# EasyEDA Pro project P1.epro

# Schematic Schematic4
Board Name: Light source; Create Date: 2026-08-11; Page Name: P1; Project Name: Banc d'essai; Schematic Name: Schematic4; Update Date: 2026-09-05; Company: EasyEDA.com; Page Size: A3; Version: V1.0
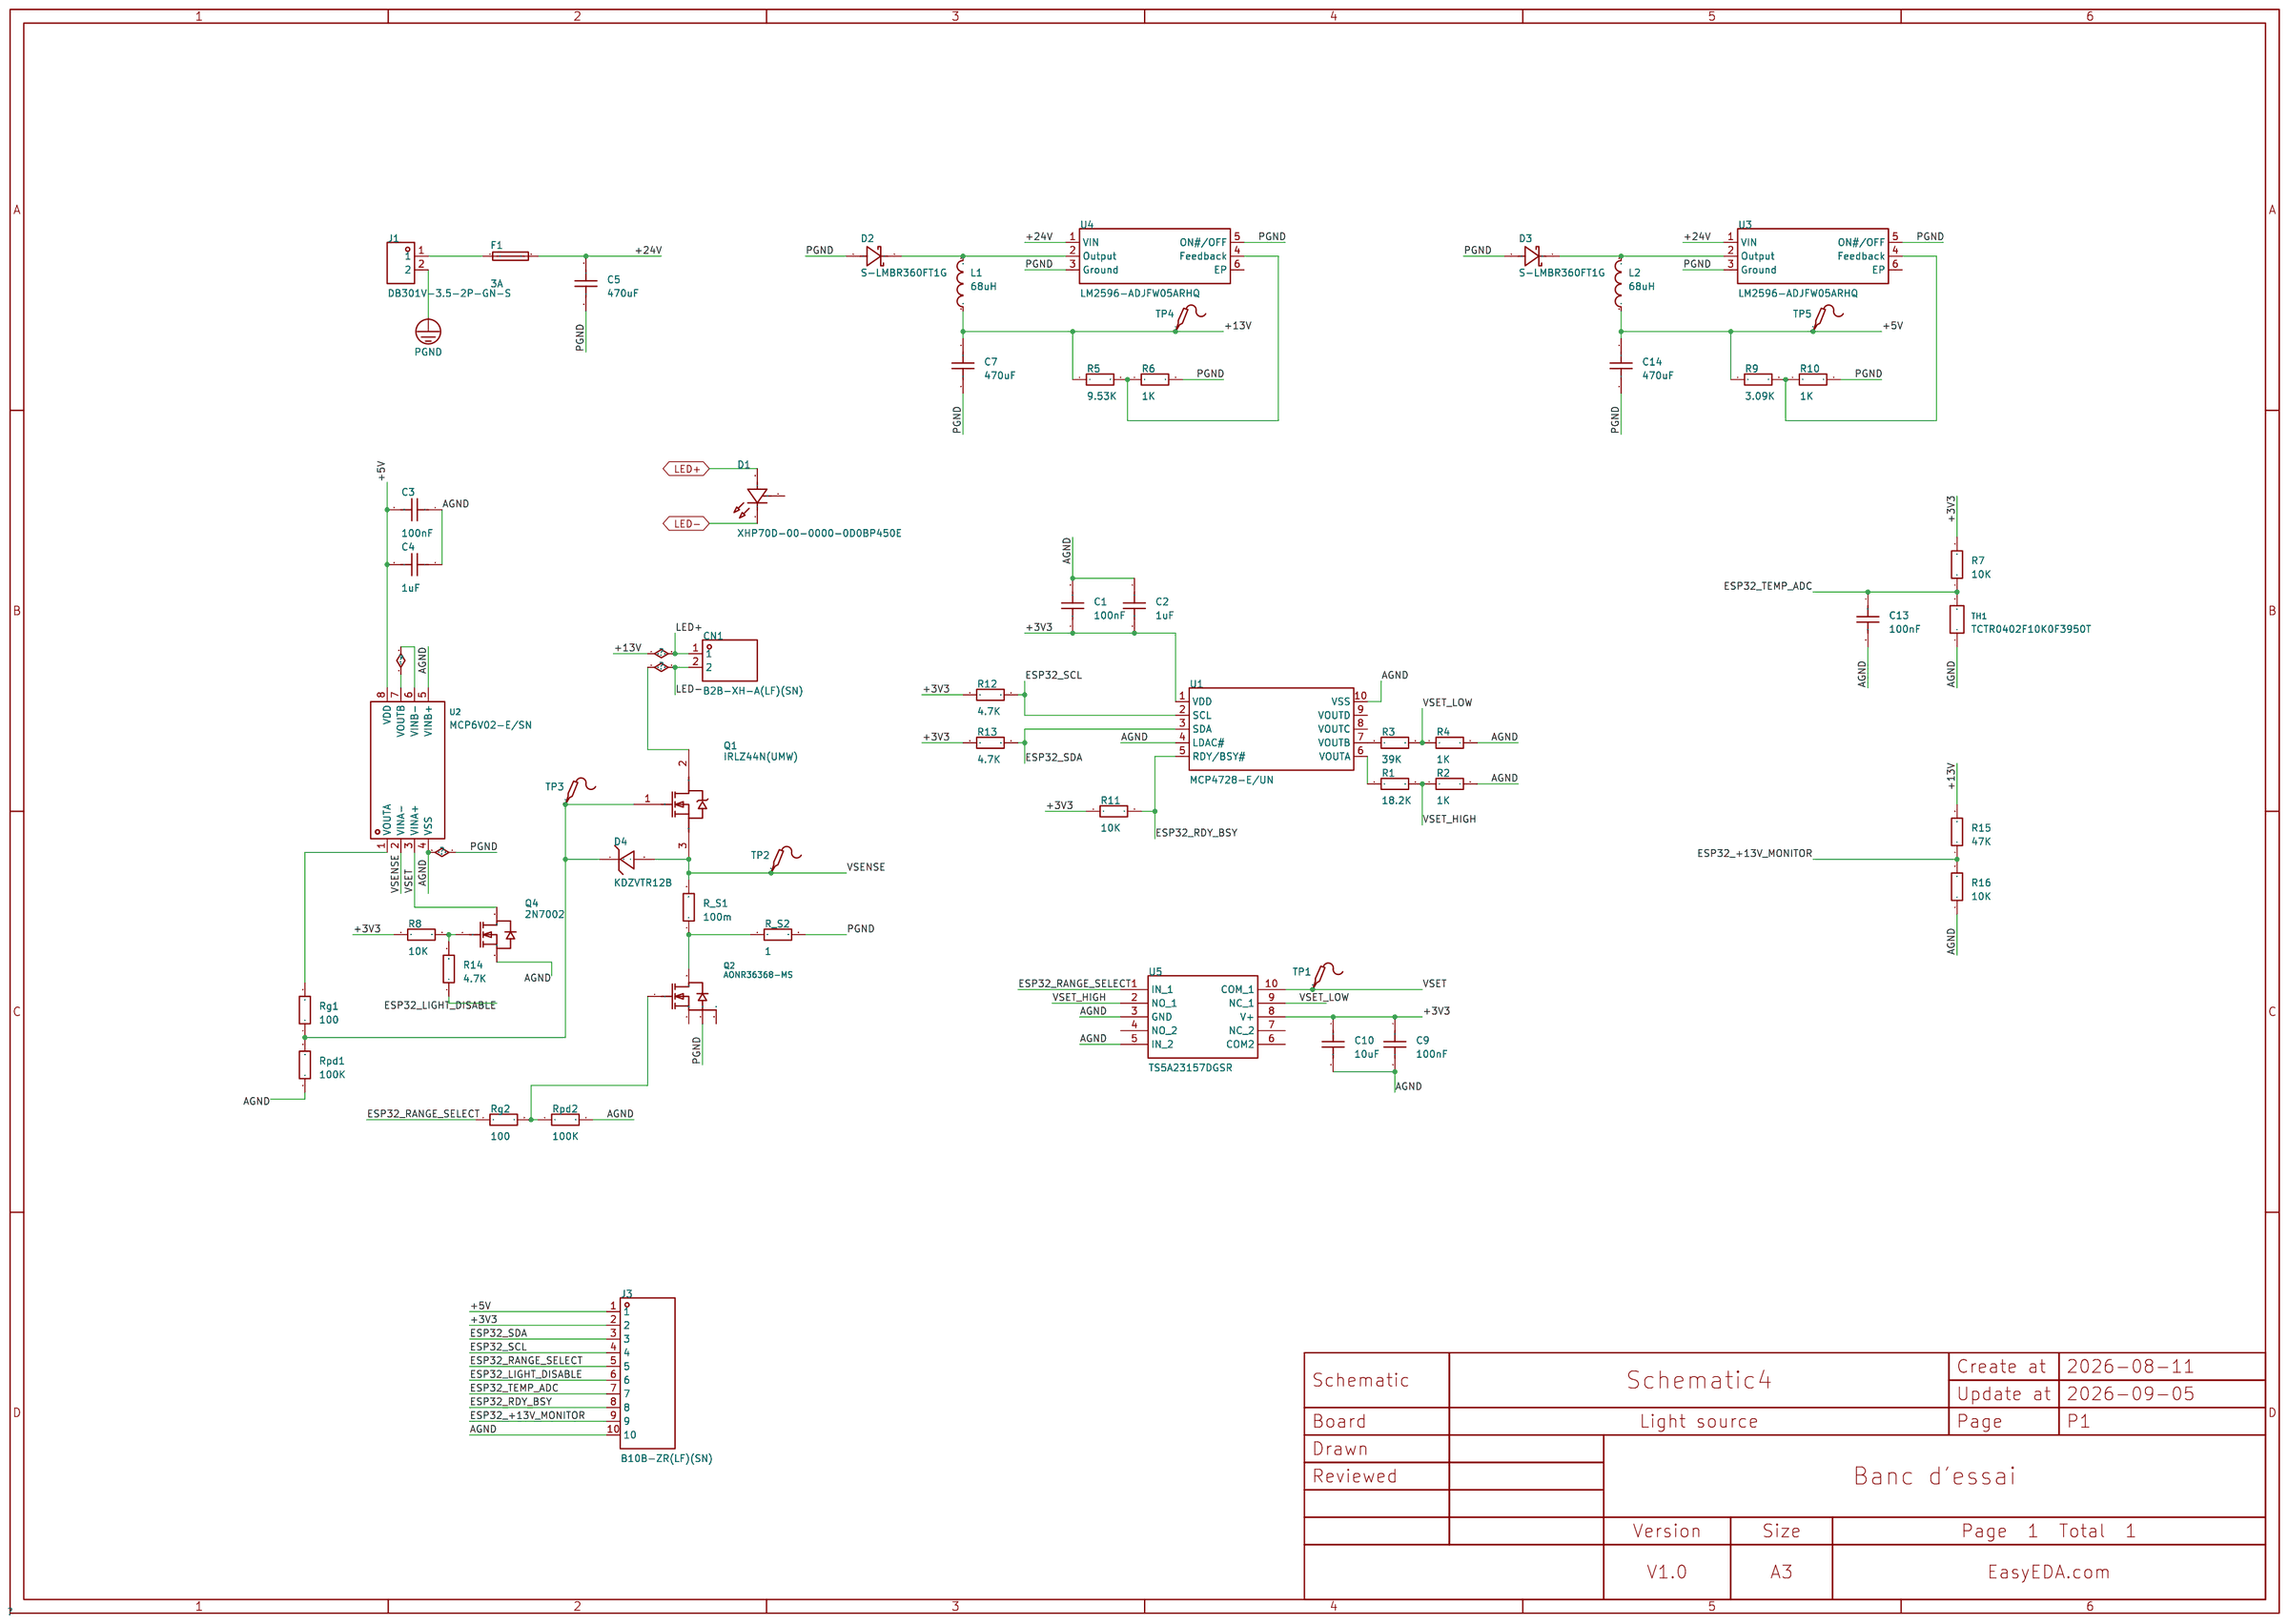
[diagram p0: schematic sheet]

## Parts
C1  100nF  [C0603]
C2  1uF  [C0603]
C3  100nF  [C0603]
C4  1uF  [C0603]
C5  470uF  [C0603]
C7  470uF  [C0603]
C9  100nF  [C0603]
C10  10uF  [C0603]
C13  100nF  [C0603]
C14  470uF  [C0603]
CN1  B2B-XH-A(LF)(SN)  [CONN-TH_B2B-XH-A-LF-SN]
D1  XHP70D-00-0000-0D0BP450E  [LED-SMD_3P-L7.0-W7.0_XHP70B-00-0000-0D0BP20E2]
D2  S-LMBR360FT1G  [SOD-123FL_L2.8-W1.9-LS3.7-RD]
D3  S-LMBR360FT1G  [SOD-123FL_L2.8-W1.9-LS3.7-RD]
D4  KDZVTR12B  [SOD-123FL_L2.7-W1.8-LS3.8-RD]
F1  3A  [FUSE-TH_L24.4-W9.4-P22.60]
J1  DB301V-3.5-2P-GN-S  [CONN-TH_DB301V-3.5-2P-GN]
J3  B10B-ZR(LF)(SN)  [CONN-TH_B10B-ZR-LF-SN]
L1  68uH  [L0603]
L2  68uH  [L0603]
Q1  IRLZ44N(UMW)  [TO-220-3_L10.2-W4.5-P2.54-L]
Q2  AONR36368-MS  [DFN-8_L3.1-W3.1-P0.65-BL-EP_AONR36368-MS]
Q4  2N7002  [SOT-23-3_L2.9-W1.3-P1.90-LS2.4-BR]
R1  18.2K  [R0603]
R2  1K  [R0603]
R3  39K  [R0603]
R4  1K  [R0603]
R5  9.53K  [R0603]
R6  1K  [R0603]
R7  10K  [R0603]
R8  10K  [R0603]
R9  3.09K  [R0603]
R10  1K  [R0603]
R11  10K  [R0603]
R12  4.7K  [R0603]
R13  4.7K  [R0603]
R14  4.7K  [R0603]
R15  47K  [R0603]
R16  10K  [R0603]
R_S1  100m  [R0603]
R_S2  1  [R0603]
Rg1  100  [R0603]
Rg2  100  [R0603]
Rpd1  100K  [R0603]
Rpd2  100K  [R0603]
TH1  TCTR0402F10K0F3950T  [R0402]
TP1  -  [Test-Point-0.5mm]
TP2  -  [Test-Point-0.5mm]
TP3  -  [Test-Point-0.5mm]
TP4  -  [Test-Point-0.5mm]
TP5  -  [Test-Point-0.5mm]
U1  MCP4728-E/UN  [MSOP-10_L3.0-W3.0-P0.50-LS5.0-TL]
U2  MCP6V02-E/SN  [SOIC-8_L4.9-W3.9-P1.27-LS6.0-BL]
U3  LM2596-ADJFW05ARHQ  [TO-263-5_L10.1-W8.7-P1.70-LS14.4-BR]
U4  LM2596-ADJFW05ARHQ  [TO-263-5_L10.1-W8.7-P1.70-LS14.4-BR]
U5  TS5A23157DGSR  [MSOP-10_L3.0-W3.0-P0.50-LS5.0-BL]

## Library data of the parts
C1-C5 C7 C9 C10 C13 C14 = CAP_0603: Supplier Footprint: 0603
CN1 = B2B-XH-A(LF)(SN): Pins Structure:1x2P Pitch:2.5mm Mounting Type:Through Hole Reference Series:XH Number of Pins:2P Number of Rows:1 Number of PINs Per Row:2 Row Spacing:- Current Rating:3A Contact Material:Brass Contact Plating:Tin Operating Temperature:-25℃~+85℃ Operating; LCSC Part Name: 1x2P 间距:2.5mm 直插 系列:XH; Supplier Part: C158012; Manufacturer: JST; Supplier Footprint: 插件,P=2.5mm; JLCPCB Part Class: Extended Part; Datasheet: https://item.szlcsc.com/datasheet/B2B-XH-A(LF)(SN)/169360.html; Supplier: LCSC; Pins Structure: 1x2P; Pitch: 2.5mm; Mounting Type: Through Hole; Reference Series: XH; Number of Pins: 2P; Number of Rows: 1; Number of PINs Per Row: 2; Current Rating: 3A; Contact Material: Brass; Contact Plating: Tin; Operating Temperature: -25℃~+85℃; Voltage Rating: 250V; Plastic Material: PA66; Flame Retardant Rating: UL94V-0; Supplementary Features: K Pin; Color: White; Z-Height of the Board: 7mm; X-Length of Bottom Edge on Board (Spacing Line): 7.4mm; Y-Width of Bottom Edge on Board: 5.75mm
D1 = XHP70D-00-0000-0D0BP450E: Illumination Color:White Voltage - Forward(Vf):11.2V Voltage - Forward(Vf):11.2V Forward Current:1.05A Color Temperature:5000K Color Temperature:5000K Viewing Angle:120°; Supplier Part: C17579168; Manufacturer: CREE LED; Supplier Footprint: 2828; JLCPCB Part Class: Extended Part; Datasheet: https://item.szlcsc.com/datasheet/XHP70D-00-0000-0D0BP450E/18708400.html; Supplier: LCSC; Illumination Color: White; Voltage - Forward(Vf): 11.2V; Forward Current: 1.05A; Color Temperature: 5000K; Viewing Angle: 120°
D2 D3 = S-LMBR360FT1G: Voltage - Forward(Vf@If):700mV@3A Voltage - DC Reverse(Vr):60V Current - Rectified:3A Operating Junction Temperature Range:-55℃~+150℃ Operating Junction Temperature Range:-55℃~+150℃ Non-Repetitive Peak Forward Surge Current:80A; LCSC Part Name: 电压:60V 电流:3A; Supplier Part: C5383051; Manufacturer: LRC(乐山无线电); Supplier Footprint: SOD-123FL; JLCPCB Part Class: Extended Part; Datasheet: https://item.szlcsc.com/datasheet/S-LMBR360FT1G/6258190.html; Supplier: LCSC; Voltage - Forward(Vf@If): 700mV@3A; Voltage - DC Reverse(Vr): 60V; Current - Rectified: 3A; Operating Junction Temperature Range: -55℃~+150℃; Non-Repetitive Peak Forward Surge Current: 80A
D4 = KDZVTR12B: Diode Configuration:1 Independent Zener Voltage(Nom):12V Reverse Leakage Current (Ir):10uA@9V Zener Voltage(Range):12V~13.5V Zener Voltage(Range):12V~13.5V Pd - Power Dissipation:1W Impedance(Zzt):- Impedance(Zzk):- Operating Junction Temperature Range:-; LCSC Part Name: 独立式 耐压:12V 电流:10uA@9V; Supplier Part: C209599; Manufacturer: ROHM(罗姆); Supplier Footprint: SOD-123FL; JLCPCB Part Class: Extended Part; Datasheet: https://item.szlcsc.com/datasheet/KDZVTR12B/210588.html; Supplier: LCSC; Diode Configuration: 1 Independent; Zener Voltage(Nom): 12V; Reverse Leakage Current (Ir): 10uA@9V; Zener Voltage(Range): 12V~13.5V; Pd - Power Dissipation: 1W
F1 = PTF-77: Fuseholder Type:Bracket type Number of Circuits:1 Voltage Rating:250V Current Rating:20A Fuse Type:Cylindrical Fuse Diameter (φD):5mm Fuse Length:20mm; LCSC Part Name: 2件套 保险丝座 5x20mm 绿色; Supplier Part: C717030; Manufacturer: XFCN(兴飞); Supplier Footprint: 插件,P=22.5mm; JLCPCB Part Class: Extended Part; Datasheet: https://item.szlcsc.com/datasheet/PTF-77/757629.html; Supplier: LCSC; Fuseholder Type: Bracket type; Number of Circuits: 1; Voltage Rating: 250V; Current Rating: 20A; Fuse Type: Cylindrical; Fuse Diameter (φD): 5mm; Fuse Length: 20mm
J1 = DB301V-3.5-2P-GN-S: Number of Positions or Pins:1x2P Pitch:3.5mm Color:Green Mounting Type:Through Hole Number of Pins:2P Number of Rows:1 Number of PINs Per Row:2 Screw Specification:M2 Current Rating:7A Voltage Rating (Max):300V Wire Gauge - AWG:18~24 Wire Gauge - mm2:0.5~; LCSC Part Name: 1x2P 3.5mm 直插 排数:1 每排P数:2; Supplier Part: C695629; Manufacturer: DORABO(地博电气); Supplier Footprint: 插件,P=3.5mm; JLCPCB Part Class: Extended Part; Datasheet: https://item.szlcsc.com/datasheet/DB301V-3.5-2P-GN-S/728965.html; Supplier: LCSC; Number of Positions or Pins: 1x2P; Pitch: 3.5mm; Color: Green; Mounting Type: Through Hole; Number of Pins: 2P; Number of Rows: 1; Number of PINs Per Row: 2; Screw Specification: M2; Current Rating: 7A; Voltage Rating (Max): 300V; Wire Gauge - AWG: 18~24; Wire Gauge - mm2: 0.5~1; Operating Temperature: -40℃~+105℃; Height Above Board: 8.5mm
J3 = B10B-ZR(LF)(SN): Pins Structure:1x10P Pitch:1.5mm Mounting Type:Through Hole Reference Series:ZH Number of Pins:10P Number of Rows:1 Number of PINs Per Row:10 Row Spacing:- Current Rating:1A Contact Material:Brass Contact Plating:Tin Operating Temperature:-25℃~+85℃ Operat; LCSC Part Name: 1x10P 间距:1.5mm 直插 系列:ZH; Supplier Part: C158036; Manufacturer: JST; Supplier Footprint: 插件,P=1.5mm; JLCPCB Part Class: Extended Part; Datasheet: https://item.szlcsc.com/datasheet/B10B-ZR(LF)(SN)/169384.html; Supplier: LCSC; Pins Structure: 1x10P; Pitch: 1.5mm; Mounting Type: Through Hole; Reference Series: ZH; Number of Pins: 10P; Number of Rows: 1; Number of PINs Per Row: 10; Current Rating: 1A; Contact Material: Brass; Contact Plating: Tin; Operating Temperature: -25℃~+85℃; Voltage Rating: 50V; Plastic Material: Glass fiber reinforced PA66; Flame Retardant Rating: UL94V-0; Color: White; Z-Height of the Board: 4.5mm; X-Length of Bottom Edge on Board (Spacing Line): 16.5mm; Y-Width of Bottom Edge on Board: 3.5mm
L1 L2 = L_0603
Q1 = IRLZ44N(UMW): Number:1 N-Channel Drain to Source Voltage:55V Current - Continuous Drain(Id):47A RDS(on):22mΩ@10V Pd - Power Dissipation:110W Gate Threshold Voltage (Vgs(th)):2V@250uA Gate Charge(Qg):48nC Input Capacitance(Ciss):1.7nF Reverse Transfer Capacitance (Crss@; LCSC Part Name: 55V N沟道MOSFET; Supplier Part: C42370423; Manufacturer: UMW(友台半导体); Supplier Footprint: TO-220; JLCPCB Part Class: Extended Part; Datasheet: https://item.szlcsc.com/datasheet/IRLZ44N(UMW)/44244386.html; Supplier: LCSC; Number: 1 N-Channel; Drain to Source Voltage: 55V; Current - Continuous Drain(Id): 47A; RDS(on): 22mΩ@10V; Pd - Power Dissipation: 110W; Gate Threshold Voltage (Vgs(th)): 2V@250uA; Gate Charge(Qg): 48nC; Input Capacitance(Ciss): 1.7nF; Reverse Transfer Capacitance (Crss@Vds): 150pF; Operating Temperature: -55℃~+175℃; Type: N-Channel; Output Capacitance(Coss): 400pF
Q2 = AONR36368-MS: Type:1 N-Channel Drain Source Voltage (Vdss): Continuous Drain Current (Id): Drain Source On Resistance (RDS(on)@Vgs,Id):6mΩ@10V Gate Threshold Voltage (Vgs(th)@Id):2.5V; LCSC Part Name: 1个N沟道 耐压:30V 电流:60A; Supplier Part: C17702943; Manufacturer: MSKSEMI(美森科); Supplier Footprint: DFN3x3-8L; JLCPCB Part Class: Extended Part; Datasheet: https://atta.szlcsc.com/upload/public/pdf/source/20230927/CF83EEA58387C726CE4325E11C2D3B0B.pdf; Supplier: LCSC; Type: 1 N-Channel; Drain Source On Resistance (RDS(on)@Vgs,Id): 6mΩ@10V; Gate Threshold Voltage (Vgs(th)@Id): 2.5V
Q4 = 2N7002_C8545: Number:1 N-channel Drain to Source Voltage:60V Current - Continuous Drain(Id):115mA RDS(on):5Ω@10V Pd - Power Dissipation:225mW Gate Threshold Voltage (Vgs(th)):2.5V Gate Charge(Qg):- Input Capacitance(Ciss):50pF Reverse Transfer Capacitance (Crss@Vds):5p; LCSC Part Name: 1个N沟道 耐压:60V 电流:115mA; Supplier Part: C8545; Manufacturer: CJ(江苏长电/长晶); Supplier Footprint: SOT-23; JLCPCB Part Class: Basic Part; Datasheet: https://item.szlcsc.com/datasheet/2N7002/9040.html; Supplier: LCSC; Number: 1 N-channel; Drain to Source Voltage: 60V; Current - Continuous Drain(Id): 115mA; RDS(on): 5Ω@10V; Pd - Power Dissipation: 225mW; Gate Threshold Voltage (Vgs(th)): 2.5V; Input Capacitance(Ciss): 50pF; Reverse Transfer Capacitance (Crss@Vds): 5pF; Type: N-Channel; Output Capacitance(Coss): 25pF; Vgs: ±20V
R1-R16 R_S1 R_S2 Rg1 Rg2 Rpd1 Rpd2 = Res_0603: Supplier Footprint: 0603
TH1 = TCTR0402F10K0F3950T: Resistance @ 25℃: B Constant (25℃/50℃): Resistance Tolerance: B Constant (25℃/75℃):- B Constant (25℃/85℃):- B Constant (25℃/100℃):- Power: B Constant Tolerance: Steady State Current (Max):- Operating Temperature:-40℃~+125℃ Operating Temperature:-40℃~+125℃; LCSC Part Name: 10kΩ 电阻精度:±1% 3950K; Supplier Part: C525371; Manufacturer: RESI(开步睿思）; Supplier Footprint: 0402; JLCPCB Part Class: Extended Part; Datasheet: https://atta.szlcsc.com/upload/public/pdf/source/20200506/C525364_82DA399420FD8342B6C8F2E2EC87328D.pdf; Supplier: LCSC; Operating Temperature: -40℃~+125℃
TP1-TP5 = Test-Point: Test Point 测试点
U1 = MCP4728-E/UN: Resolution (Bits):12 Number of Channels:4 Interface:I2C Voltage - Supply:2.7V~5.5V Voltage - Supply:2.7V~5.5V Settling Time:6us Output Type:Voltage Buffer Integral non - linearity:2LSB Integral non - linearity:2LSB Operating Temperature:-40℃~+125℃ Operati; LCSC Part Name: 12位四通道带EEPROM存储器的数模转换器; Supplier Part: C108207; Manufacturer: MICROCHIP(美国微芯); Supplier Footprint: MSOP-10; JLCPCB Part Class: Extended Part; Datasheet: https://item.szlcsc.com/datasheet/MCP4728-E%252FUN/109426.html; Supplier: LCSC; Resolution (Bits): 12; Number of Channels: 4; Interface: I2C; Voltage - Supply: 2.7V~5.5V; Settling Time: 6us; Output Type: Voltage Buffer; Integral non - linearity: 2LSB; Operating Temperature: -40℃~+125℃; Function: Programmable gain；Integrated buffer；Power-down mode；Power-on reset; Quiescent Current (Iq): 40nA
U2 = MCP6V02-E/SN: Number of Circuits:双路 Gain Bandwidth Product(GBP):1.3MHz Current - Input Bias(Ib):1pA Voltage - Input Offset(Vos):2uV Slew Rate(SR):0.5V/us Supply Voltage:1.8V~5.5V Supply Voltage:1.8V~5.5V -3db Bandwidth(G=1):- Output Type:- Rail to Rail:- Supply Current; Supplier Part: C47081; Manufacturer: MICROCHIP(美国微芯); Supplier Footprint: SOIC-8; JLCPCB Part Class: Extended Part; Datasheet: https://atta.szlcsc.com/upload/public/pdf/source/20220119/C1348516_7056A8E4D422962B4648026286D6E4C0.pdf; Supplier: LCSC; Number of Circuits: 双路; Gain Bandwidth Product(GBP): 1.3MHz; Current - Input Bias(Ib): 1pA; Voltage - Input Offset(Vos): 2uV; Slew Rate(SR): 0.5V/us; Supply Voltage: 1.8V~5.5V; Supply Current: 300uA; Operating Temperature: -40℃~+125℃
U3 U4 = LM2596-ADJFW05ARHQ: Function:Step-down type Voltage - Supply:4.5V~40V Voltage - Supply:4.5V~40V Output Voltage:1.2V~37V Output Voltage:1.2V~37V Output Current:3A Frequency - Switching:150kHz Frequency - Switching:150kHz Operating Temperature:-40℃~+125℃ Operating Temperature:; LCSC Part Name: 降压型 3A 4.5V~40V; Supplier Part: C49443605; Manufacturer: GR(国睿); Supplier Footprint: TO-263-5; JLCPCB Part Class: Extended Part; Datasheet: https://item.szlcsc.com/datasheet/LM2596-ADJFW05ARHQ/51983582.html; Supplier: LCSC; Function: Step-down type; Voltage - Supply: 4.5V~40V; Output Voltage: 1.2V~37V; Output Current: 3A; Frequency - Switching: 150kHz; Operating Temperature: -40℃~+125℃; Number of Outputs: 1; Topology: Buck; Quiescent Current: 5mA; Switch tube (built-in/external): Built-in; Output Type: Adjustable; Features: Overcurrent Protection
U5 = TS5A23157DGSR: Switch Circuit:2:1 Number of Channels:2 Ron:10Ω Voltage - Supply:1.65V~5.5V Voltage - Supply:1.65V~5.5V Con:17.5pF Turn-on time:1.7ns Turn-off time:800ps Bandwidth:220MHz Operating Temperature:-40℃~+85℃ Operating Temperature:-40℃~+85℃ Propagation Delay (t; LCSC Part Name: TS5A23157 双 10Ω SPDT 模拟开关; Supplier Part: C11133; Manufacturer: TI(德州仪器); Supplier Footprint: MSOP-10; JLCPCB Part Class: Extended Part; Datasheet: https://www.ti.com/cn/lit/gpn/ts5a23157; Supplier: LCSC; Switch Circuit: 2:1; Number of Channels: 2; Ron: 10Ω; Voltage - Supply: 1.65V~5.5V; Con: 17.5pF; Turn-on time: 1.7ns; Turn-off time: 800ps; Bandwidth: 220MHz; Operating Temperature: -40℃~+85℃; Features: Bidirectional analog channel；Glitch-free switching

## Nets
+3V3: C1.1 C2.2 C9.1 C10.1 J3.2 R7.2 R8.1 R11.1 R12.1 R13.1 U1.1(VDD) U5.8(V+)
+5V: C3.2 C4.2 C14.1 J3.1 L2.1 R9.1 TP5.1 U2.8(VDD)
+13V: C7.1 CN1.1 D1.3(A) L1.1 R5.1 R15.2 TP4.1
+24V: C5.1 F1.2 U3.1(VIN) U4.1(VIN)
PGND: C1.2 C2.1 C3.1 C4.1 C5.2 C7.2 C9.2 C10.2 C13.2 C14.2 D2.2(A) D3.2(A) J1.2 J3.10 Q2.2(S) Q4.2(S) R2.2 R4.2 R6.2 R10.2 R16.1 R_S2.2 Rpd1.1 Rpd2.2 TH1.1 U1.4(LDAC#) U1.10(VSS) U2.4(VSS) U2.5(VINB+) U3.3(Ground) U3.5(ON#/OFF) U4.3(Ground) U4.5(ON#/OFF) U5.3(GND) U5.5(IN 2)
ESP32_+13V_MONITOR: J3.9 R15.1 R16.2
ESP32_LIGHT_DISABLE: J3.6 R14.1
ESP32_RANGE_SELECT: J3.5 Rg2.1 U5.1(IN 1)
ESP32_RDY_BSY: J3.8 R11.2 U1.5(RDY/BSY#)
ESP32_SCL: J3.4 R12.2 U1.2(SCL)
ESP32_SDA: J3.3 R13.2 U1.3(SDA)
ESP32_TEMP_ADC: C13.1 J3.7 R7.1 TH1.2
LED-: CN1.2 D1.1(K) Q1.2(D)
VSENSE: D4.2(A) Q1.3(S) R_S1.2 TP2.1 U2.2(VINA-)
VSET: Q4.3(D) TP1.1 U2.3(VINA+) U5.10(COM 1)
VSET_HIGH: R1.2 R2.1 U5.2(NO 1)
VSET_LOW: R3.2 R4.1 U5.9(NC 1)
Net-(D2-1): D2.1(K) L1.2 U4.2(Output)
Net-(D3-1): D3.1(K) L2.2 U3.2(Output)
Net-(D4-1): D4.1(K) Q1.1(G) Rg1.1 Rpd1.2 TP3.1
Net-(F1-1): F1.1 J1.1
Net-(Q2-4): Q2.4(G) Rg2.2 Rpd2.1
Net-(Q2-5): Q2.5(D) R_S1.1 R_S2.1
Net-(Q4-1): Q4.1(G) R8.2 R14.2
Net-(R1-1): R1.1 U1.6(VOUTA)
Net-(R3-1): R3.1 U1.7(VOUTB)
Net-(R5-2): R5.2 R6.1 U4.4(Feedback)
Net-(R9-2): R9.2 R10.1 U3.4(Feedback)
Net-(Rg1-2): Rg1.2 U2.1(VOUTA)
Net-(U2-6): U2.6(VINB-) U2.7(VOUTB)

Not connected (* = marked no-connect by the designer): D1 2(NC); Q2 1(S) 3(S); U1 8(VOUTC) 9(VOUTD); U3 6(EP); U4 6(EP); U5 4(NO 2) 6(COM2) 7(NC 2)
